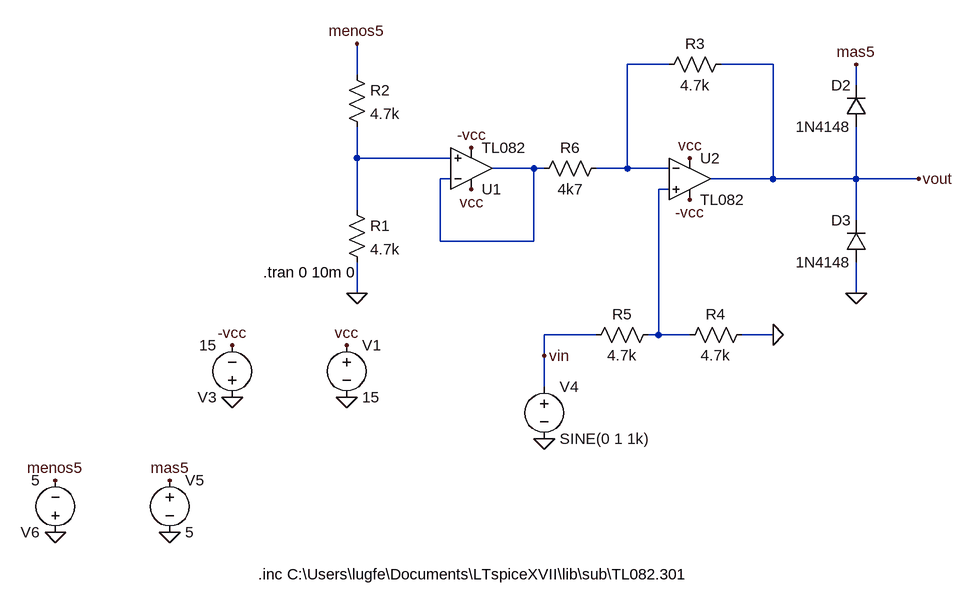
[diagram p0: schematic sim.asc]
sim.asc, the LTspice schematic file:
Version 4
SHEET 1 1136 820
WIRE 464 -16 400 -16
WIRE 624 -16 544 -16
WIRE -16 0 -16 -48
WIRE 752 16 752 -16
WIRE -16 128 -16 80
WIRE 128 128 -16 128
WIRE 256 144 192 144
WIRE 272 144 256 144
WIRE 400 144 400 -16
WIRE 400 144 352 144
WIRE 464 144 400 144
WIRE 128 160 112 160
WIRE 624 160 624 -16
WIRE 624 160 528 160
WIRE 752 160 752 80
WIRE 752 160 624 160
WIRE 848 160 752 160
WIRE 464 176 448 176
WIRE -16 208 -16 128
WIRE 752 224 752 160
WIRE 112 256 112 160
WIRE 256 256 256 144
WIRE 256 256 112 256
WIRE -16 336 -16 288
WIRE 752 336 752 288
WIRE 352 400 272 400
WIRE 448 400 448 176
WIRE 448 400 432 400
WIRE 496 400 448 400
WIRE 624 400 576 400
WIRE 272 432 272 400
WIRE 272 480 272 432
FLAG 160 176 vcc
FLAG -32 416 vcc
FLAG -32 496 0
FLAG -208 416 -vcc
FLAG -208 496 0
FLAG 160 112 -vcc
FLAG 752 336 0
FLAG 624 400 0
FLAG -16 336 0
FLAG 496 192 -vcc
FLAG 496 128 vcc
FLAG -16 -48 menos5
FLAG 272 560 0
FLAG 272 432 vin
FLAG -304 624 mas5
FLAG -304 704 0
FLAG -480 624 menos5
FLAG -480 704 0
FLAG 752 -16 mas5
FLAG 848 160 vout
SYMBOL Opamps\\opamp2 160 208 M180
SYMATTR InstName U1
SYMATTR Value TL082
SYMBOL voltage -32 400 R0
WINDOW 123 0 0 Left 0
WINDOW 39 0 0 Left 0
SYMATTR InstName V1
SYMATTR Value 15
SYMBOL voltage -208 512 R180
WINDOW 123 0 0 Left 0
WINDOW 39 0 0 Left 0
SYMATTR InstName V3
SYMATTR Value 15
SYMBOL res -32 192 R0
SYMATTR InstName R1
SYMATTR Value 4.7k
SYMBOL res -32 -16 R0
SYMATTR InstName R2
SYMATTR Value 4.7k
SYMBOL Opamps\\opamp2 496 96 R0
SYMATTR InstName U2
SYMATTR Value TL082
SYMBOL res 560 -32 R90
WINDOW 0 0 56 VBottom 2
WINDOW 3 32 56 VTop 2
SYMATTR InstName R3
SYMATTR Value 4.7k
SYMBOL res 592 384 R90
WINDOW 0 0 56 VBottom 2
WINDOW 3 32 56 VTop 2
SYMATTR InstName R4
SYMATTR Value 4.7k
SYMBOL res 448 384 R90
WINDOW 0 0 56 VBottom 2
WINDOW 3 32 56 VTop 2
SYMATTR InstName R5
SYMATTR Value 4.7k
SYMBOL diode 768 80 R180
WINDOW 0 24 64 Left 2
WINDOW 3 24 0 Left 2
SYMATTR InstName D2
SYMATTR Value 1N4148
SYMBOL voltage 272 464 R0
WINDOW 123 0 0 Left 0
WINDOW 39 0 0 Left 0
SYMATTR InstName V4
SYMATTR Value SINE(0 1 1k)
SYMBOL voltage -304 608 R0
WINDOW 123 0 0 Left 0
WINDOW 39 0 0 Left 0
SYMATTR InstName V5
SYMATTR Value 5
SYMBOL voltage -480 720 R180
WINDOW 123 0 0 Left 0
WINDOW 39 0 0 Left 0
SYMATTR InstName V6
SYMATTR Value 5
SYMBOL diode 768 288 R180
WINDOW 0 24 64 Left 2
WINDOW 3 24 0 Left 2
SYMATTR InstName D3
SYMATTR Value 1N4148
SYMBOL res 368 128 R90
WINDOW 0 0 56 VBottom 2
WINDOW 3 32 56 VTop 2
SYMATTR InstName R6
SYMATTR Value 4k7
TEXT -168 768 Left 2 !.inc C:\\Users\\lugfe\\Documents\\LTspiceXVII\\lib\\sub\\TL082.301
TEXT -160 304 Left 2 !.tran 0 10m 0

The netlist it stands for:
* sim.asc
XU1 N002 N003 vcc -vcc N003 TL082  ; pins In+ In- V+ V- OUT
V1 vcc 0 15
V3 0 -vcc 15
R1 N002 0 4.7k
R2 menos5 N002 4.7k
XU2 N004 N001 vcc -vcc vout TL082  ; pins In+ In- V+ V- OUT
R3 vout N001 4.7k
R4 0 N004 4.7k
R5 N004 vin 4.7k
D2 vout mas5 1N4148
V4 vin 0 SINE(0 1 1k)
V5 mas5 0 5
V6 0 menos5 5
D3 0 vout 1N4148
R6 N001 N003 4k7
.model D D
.lib standard.dio
.inc C:\Users\lugfe\Documents\LTspiceXVII\lib\sub\TL082.301
.tran 0 10m 0
.backanno
.end